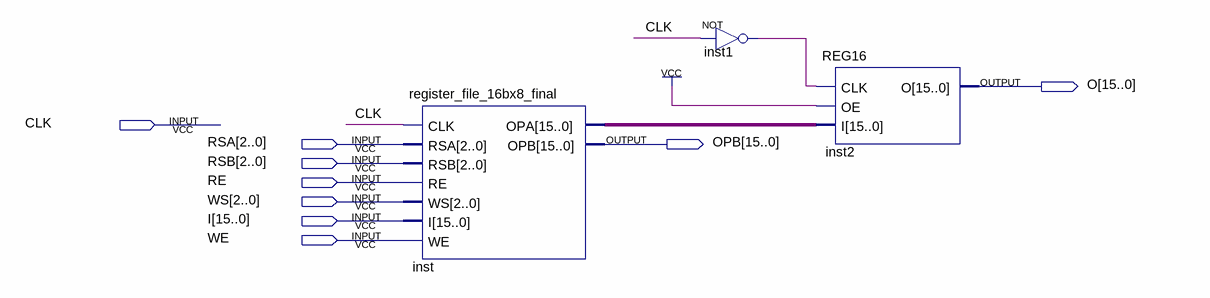
[diagram p0: schematic sheet]
// Quartus schematic demo.bdf as structural Verilog: 3 symbols, 9 pins
module demo (
  input  CLK,
  input  [2:0] RSA,
  input  [2:0] RSB,
  input  RE,
  input  [2:0] WS,
  input  [15:0] I,
  input  WE,
  output [15:0] O,
  output [15:0] OPB
);

  wire inst1_out;
  wire [15:0] inst_opa;

  register_file_16bx8_final inst (
    .CLK(CLK), .RSA(RSA), .RSB(RSB), .RE(RE), .WS(WS), .I(I), .WE(WE), .OPA(inst_opa), .OPB(OPB));
  not inst1 (inst1_out, CLK);
  REG16 inst2 (.CLK(inst1_out), .OE(1'b1), .I(inst_opa), .O(O));
endmodule
